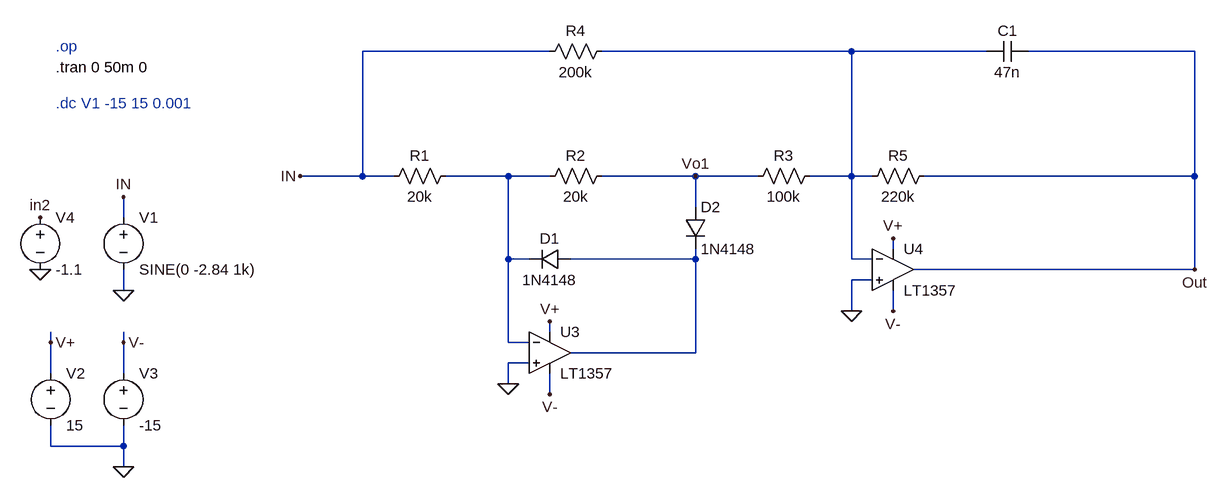
[diagram p0: schematic Etaj4.asc]
Etaj4.asc, the LTspice schematic file:
Version 4
SHEET 1 1332 880
WIRE -64 -496 -352 -496
WIRE 400 -496 16 -496
WIRE 608 -496 400 -496
WIRE 928 -496 672 -496
WIRE -352 -304 -352 -496
WIRE -352 -304 -448 -304
WIRE -304 -304 -352 -304
WIRE -128 -304 -224 -304
WIRE -64 -304 -128 -304
WIRE 160 -304 16 -304
WIRE 256 -304 160 -304
WIRE 400 -304 400 -496
WIRE 400 -304 336 -304
WIRE 432 -304 400 -304
WIRE 928 -304 928 -496
WIRE 928 -304 512 -304
WIRE 160 -256 160 -304
WIRE -720 -240 -720 -272
WIRE 464 -192 464 -208
WIRE -128 -176 -128 -304
WIRE -96 -176 -128 -176
WIRE 160 -176 160 -192
WIRE 160 -176 -32 -176
WIRE 400 -176 400 -304
WIRE 432 -176 400 -176
WIRE 928 -160 928 -304
WIRE 928 -160 496 -160
WIRE 432 -144 400 -144
WIRE -720 -128 -720 -160
WIRE 400 -96 400 -144
WIRE 464 -96 464 -128
WIRE -64 -64 -64 -80
WIRE -832 -48 -832 -64
WIRE -720 -48 -720 -64
WIRE -128 -48 -128 -176
WIRE -96 -48 -128 -48
WIRE 160 -32 160 -176
WIRE 160 -32 -32 -32
WIRE -96 -16 -128 -16
WIRE -832 0 -832 -48
WIRE -720 0 -720 -48
WIRE -128 16 -128 -16
WIRE -64 32 -64 0
WIRE -832 112 -832 80
WIRE -720 112 -720 80
WIRE -720 112 -832 112
WIRE -720 144 -720 112
FLAG -720 -128 0
FLAG -128 16 0
FLAG -720 144 0
FLAG -832 -48 V+
FLAG -720 -48 V-
FLAG -64 -80 V+
FLAG -64 32 V-
FLAG 464 -208 V+
FLAG 464 -96 V-
FLAG 400 -96 0
FLAG -720 -272 IN
FLAG -448 -304 IN
FLAG 928 -160 Out
FLAG -848 -160 0
FLAG -848 -240 in2
FLAG 160 -304 Vo1
SYMBOL voltage -720 -256 R0
WINDOW 123 0 0 Left 2
WINDOW 39 0 0 Left 2
SYMATTR InstName V1
SYMATTR Value SINE(0 -2.84 1k)
SYMBOL voltage -832 -16 R0
WINDOW 123 0 0 Left 2
WINDOW 39 0 0 Left 2
SYMATTR InstName V2
SYMATTR Value 15
SYMBOL voltage -720 -16 R0
WINDOW 123 0 0 Left 2
WINDOW 39 0 0 Left 2
SYMATTR InstName V3
SYMATTR Value -15
SYMBOL diode -32 -192 R90
WINDOW 0 0 32 VBottom 2
WINDOW 3 32 32 VTop 2
SYMATTR InstName D1
SYMATTR Value 1N4148
SYMBOL res -208 -320 R90
WINDOW 0 0 56 VBottom 2
WINDOW 3 32 56 VTop 2
SYMATTR InstName R1
SYMATTR Value 20k
SYMBOL res 32 -320 R90
WINDOW 0 0 56 VBottom 2
WINDOW 3 32 56 VTop 2
SYMATTR InstName R2
SYMATTR Value 20k
SYMBOL res 352 -320 R90
WINDOW 0 0 56 VBottom 2
WINDOW 3 32 56 VTop 2
SYMATTR InstName R3
SYMATTR Value 100k
SYMBOL res 32 -512 R90
WINDOW 0 0 56 VBottom 2
WINDOW 3 32 56 VTop 2
SYMATTR InstName R4
SYMATTR Value 200k
SYMBOL res 528 -320 R90
WINDOW 0 0 56 VBottom 2
WINDOW 3 32 56 VTop 2
SYMATTR InstName R5
SYMATTR Value 220k
SYMBOL diode 144 -256 R0
SYMATTR InstName D2
SYMATTR Value 1N4148
SYMBOL voltage -848 -256 R0
WINDOW 123 0 0 Left 0
WINDOW 39 0 0 Left 0
SYMATTR InstName V4
SYMATTR Value -1.1
SYMBOL cap 672 -512 R90
WINDOW 0 0 32 VBottom 2
WINDOW 3 32 32 VTop 2
SYMATTR InstName C1
SYMATTR Value 47n
SYMBOL OpAmps\\LT1357 -64 -96 R0
SYMATTR InstName U3
SYMBOL OpAmps\\LT1357 464 -224 R0
SYMATTR InstName U4
TEXT -824 -472 Left 2 !.tran 0 50m 0
TEXT -824 -504 Left 2 ;.op
TEXT -824 -416 Left 2 ;.dc V1 -15 15 0.001

The netlist it stands for:
* Etaj4.asc
V1 IN 0 SINE(0 -2.84 1k)
V2 V+ 0 15
V3 V- 0 -15
D1 N003 N002 1N4148
R1 N002 IN 20k
R2 Vo1 N002 20k
R3 N001 Vo1 100k
R4 N001 IN 200k
R5 Out N001 220k
D2 Vo1 N003 1N4148
V4 in2 0 -1.1
C1 Out N001 47n
XU3 0 N002 V+ V- N003 LT1357  ; pins In+ In- V+ V- OUT
XU4 0 N001 V+ V- Out LT1357  ; pins In+ In- V+ V- OUT
.model D D
.lib standard.dio
.tran 0 50m 0
* .op
* .dc V1 -15 15 0.001
.backanno
.end